# Altium schematic sheet hovercraft.SchDoc
size A4
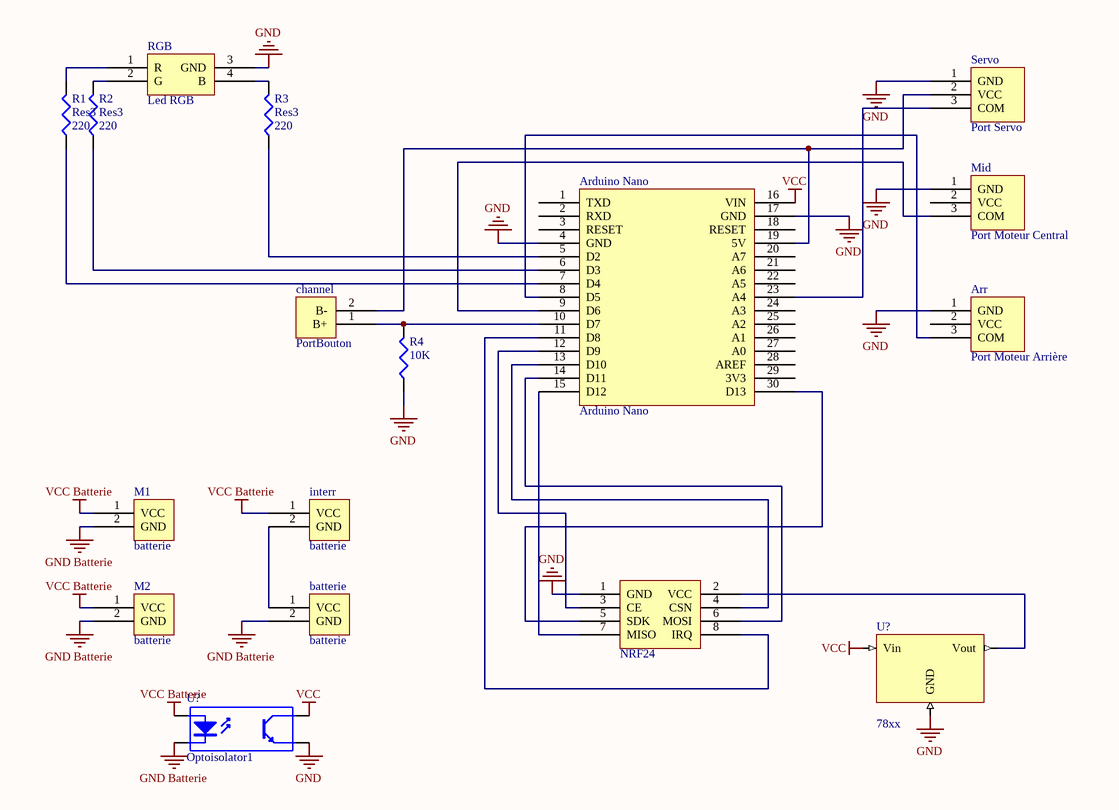
[diagram p0: hovercraft.SchDoc]

## Parts
(Parts that share a designator on the sheet are numbered #1, #2 ... from top to bottom, then left to right.)
Arduino_Nano  Arduino Nano  [Arduino Nano]
Arr  Port Moteur Arrière  [PortServomoteur]
batterie  batterie  [xt60]
channel  PortBouton  [PortBouton]
interr  batterie  [batterie]
M1  batterie  [batterie]
M2  batterie  [batterie]
Mid  Port Moteur Central  [PortServomoteur]
NRF24  NRF24  [NRF24]  (value not drawn)
R1  Res3  value 220  [J1-0603]
R2  Res3  value 220  [J1-0603]
R3  Res3  value 220  [J1-0603]
R4  value 10K  [0805]  (hidden comment: RES)
RGB  Led RGB  [Led RGB]
Servo  Port Servo  [PortServomoteur]
U?#1  78xx  [TO252]
U?#2  Optoisolator1  [DIP-4]

## Nets
GND: Arduino_Nano.4(GND) Arduino_Nano.17(GND) Arr.1(GND) Mid.1(GND) NRF24.1(GND) R4.1 RGB.3(GND) Servo.1(GND) U?#1.2(GND) U?#2.3(E)
GND Batterie: batterie.2(GND) M1.2(GND) M2.2(GND) U?#2.2(K)
VCC: Arduino_Nano.16(VIN) U?#1.1(Vin) U?#2.4(C)
VCC Batterie: interr.1(VCC) M1.1(VCC) M2.1(VCC) U?#2.1(A)
NetArduino_Nano_5: Arduino_Nano.5(D2) R3.1
NetArduino_Nano_6: Arduino_Nano.6(D3) R2.1
NetArduino_Nano_7: Arduino_Nano.7(D4) R1.1
NetArduino_Nano_8: Arduino_Nano.8(D5) Arr.3(COM)
NetArduino_Nano_9: Arduino_Nano.9(D6) Mid.3(COM)
NetArduino_Nano_10: Arduino_Nano.10(D7) channel.1(B+) R4.2
NetArduino_Nano_11: Arduino_Nano.11(D8) NRF24.8(IRQ)
NetArduino_Nano_12: Arduino_Nano.12(D9) NRF24.3(CE)
NetArduino_Nano_13: Arduino_Nano.13(D10) NRF24.4(CSN)
NetArduino_Nano_14: Arduino_Nano.14(D11) NRF24.6(MOSI)
NetArduino_Nano_15: Arduino_Nano.15(D12) NRF24.7(MISO)
NetArduino_Nano_19: Arduino_Nano.19(5V) channel.2(B-) Servo.2(VCC)
NetArduino_Nano_23: Arduino_Nano.23(A4) Servo.3(COM)
NetArduino_Nano_30: Arduino_Nano.30(D13) NRF24.5(SDK)
Netbatterie_1: batterie.1(VCC) interr.2(GND)
NetNRF24_2: NRF24.2(VCC) U?#1.3(Vout)
NetR1_2: R1.2 RGB.1(R)
NetR2_2: R2.2 RGB.2(G)
NetR3_2: R3.2 RGB.4(B)

Not connected (* = marked no-connect by the designer): Arduino_Nano 1(TXD) 2(RXD) 3(RESET) 18(RESET) 20(A7) 21(A6) 22(A5) 24(A3) 25(A2) 26(A1) 27(A0) 28(AREF) 29(3V3); Arr 2(VCC); Mid 2(VCC)

## Library data of the parts
Arr Mid = Port Servo
R1-R3 = Res3: Resistor; Published: 8-Jun-2000; LatestRevisionDate: 29-May-2009; LatestRevisionNote: IPC-7351 Footprint Added.; PackageReference: J1-0603; Publisher: Altium Limited; PackageDescription: Chip Resistor
R4 = RES: resistance
U?#1 = REG_POS: régulateur positif fixe
U?#2 = Optoisolator1: 4-Pin Phototransistor Optocoupler; Published: 24-Mar-1999; LatestRevisionDate: 04-Mar-2005; LatestRevisionNote: Sch pins 3 & 4 Swapped.; DatasheetVersion: Nov-2003; PackageReference: DIP-4; Publisher: Altium Limited